# EasyEDA Pro project PCB_Design_Project.epro

# Schematic Schematic1_8
Board Name: Prototype_V5.2_328P; Create Date: 2024-12-31; Page Name: P1; Project Name: Cleanify; Schematic Name: Schematic1_8; Update Date: 2024-12-31; Company: EasyEDA.com; Drawn: EasyEDA; Page Size: A4; Part Number: JLCPCB-002; Reviewed: EasyEDA; Version: V0.1
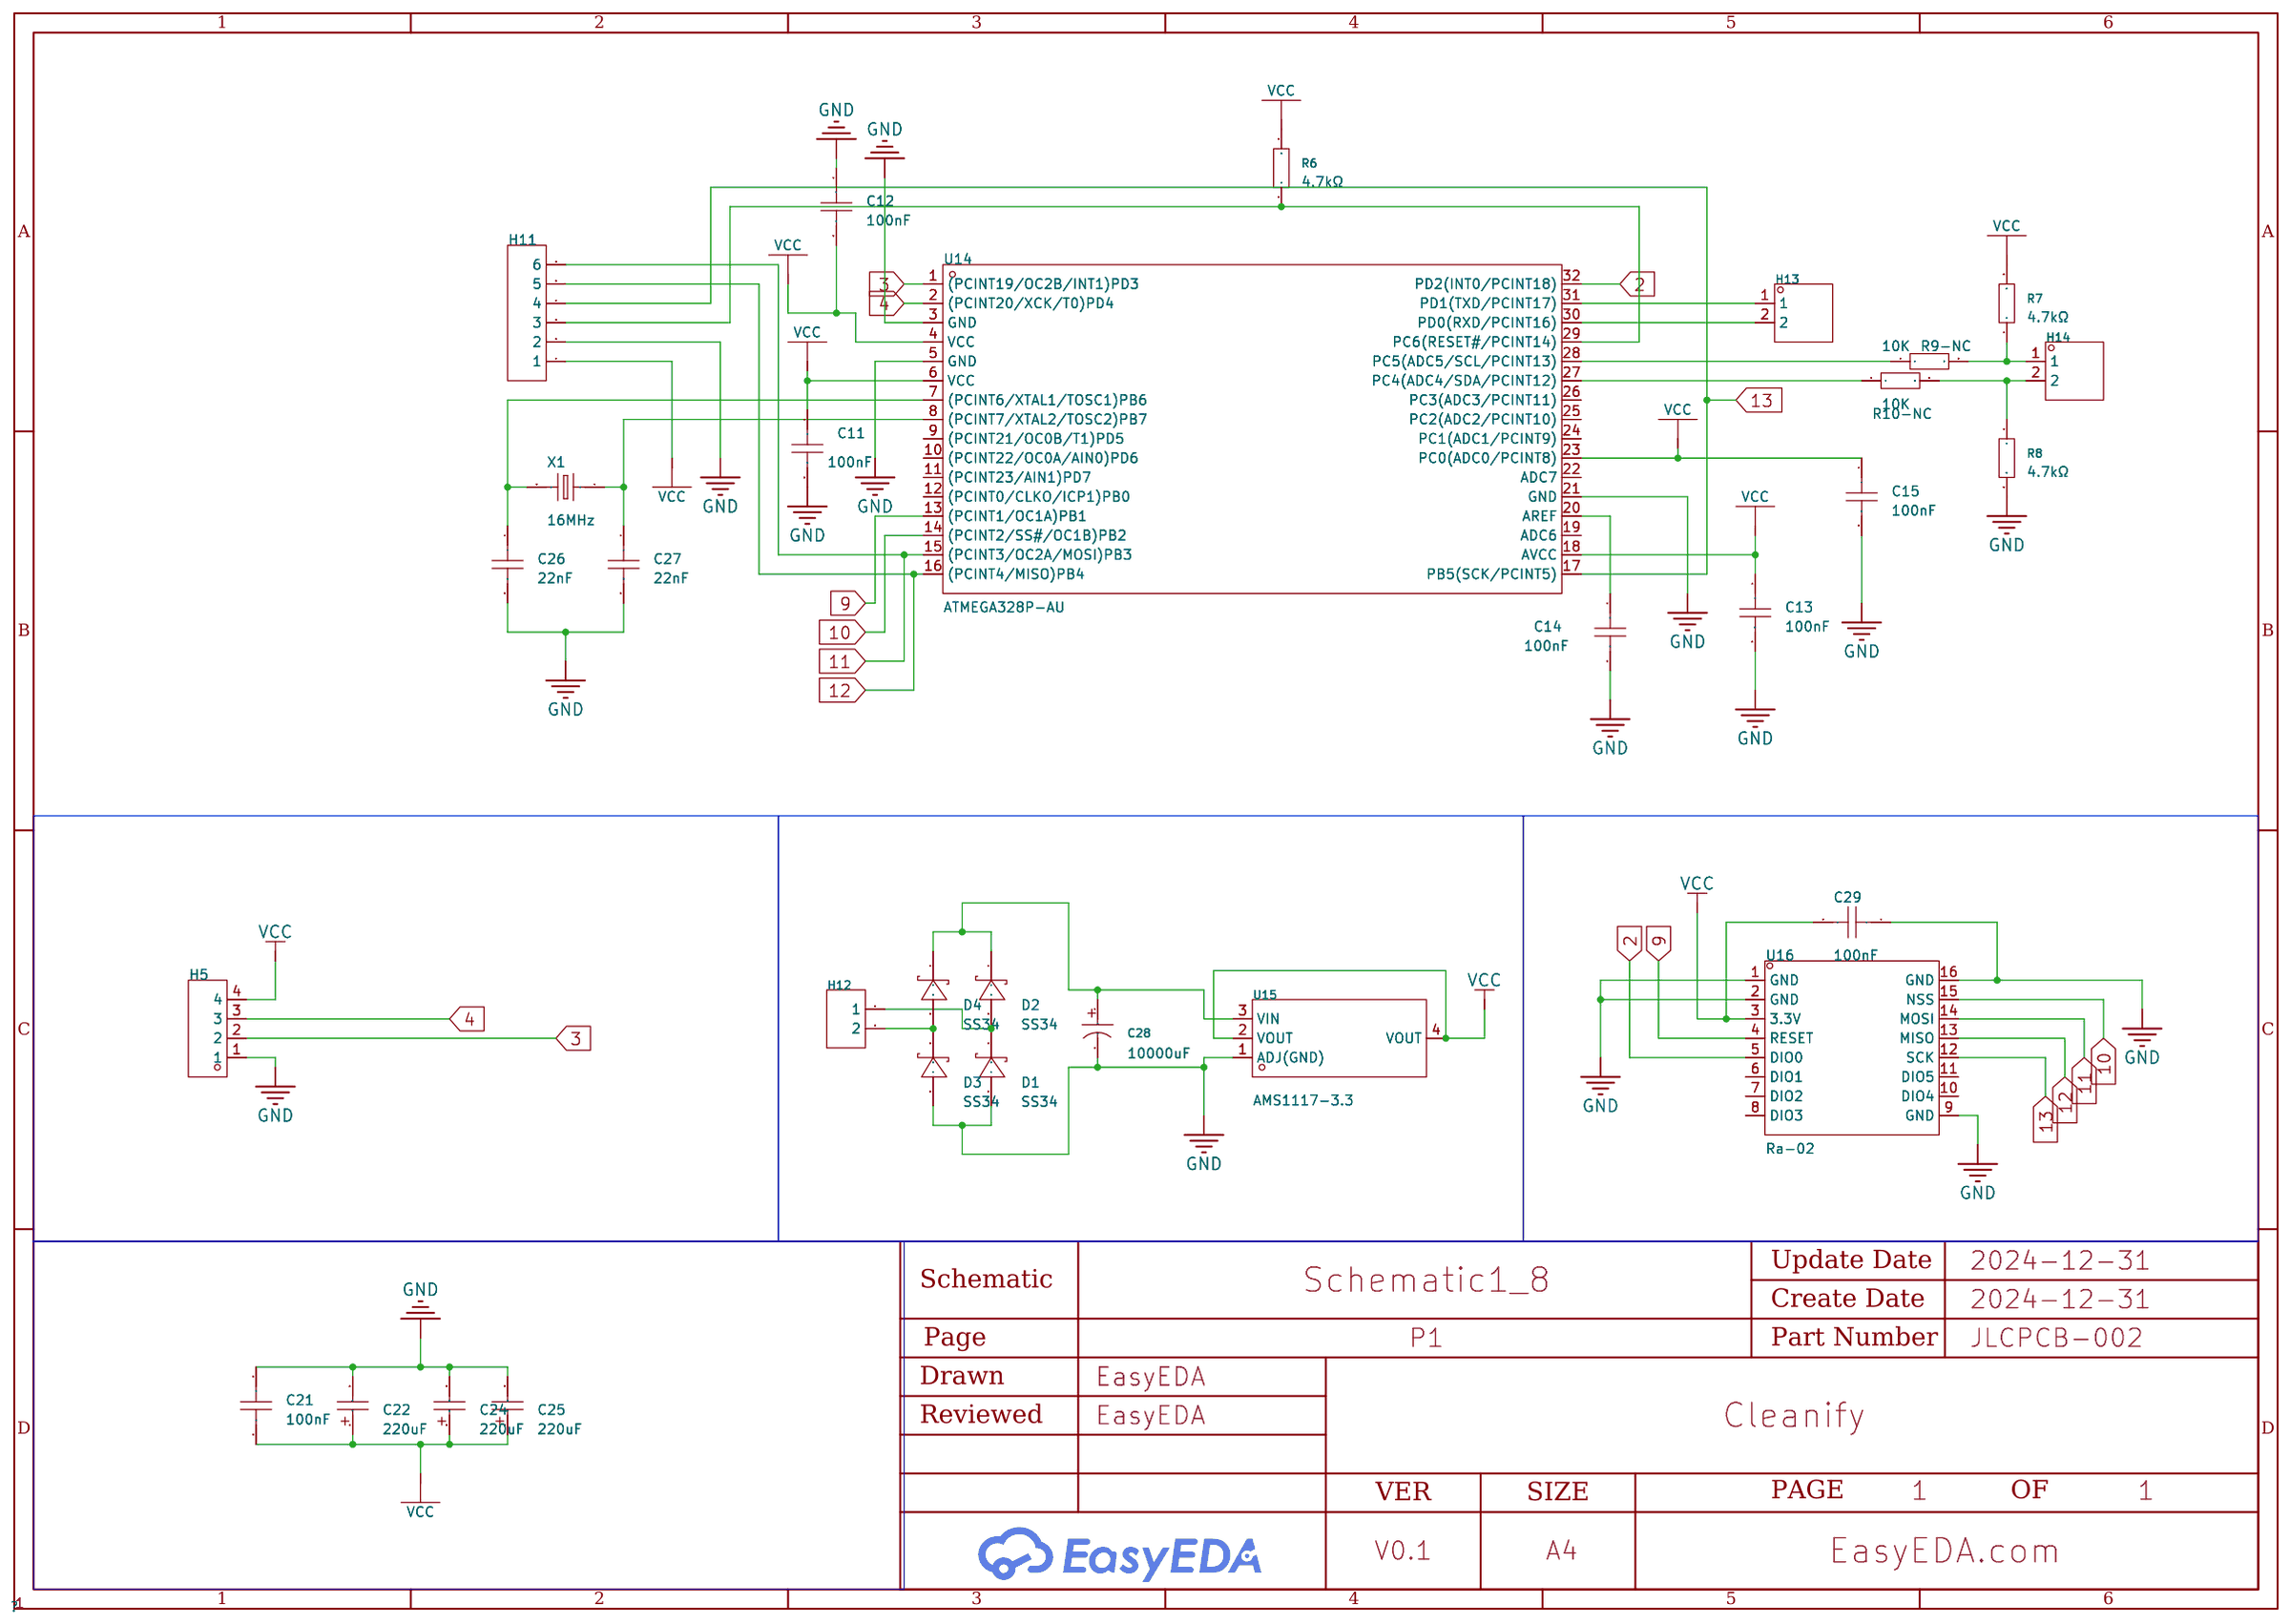
[diagram p0: schematic sheet]

## Parts
C11  100nF  [C0805]
C12  100nF  [C0805]
C13  100nF  [C0805]
C14  100nF  [C0805]
C15  100nF  [C0805]
C21  100nF  [C0805]
C22  220uF  [CAP-SMD_L3.5-W2.8-R-RD]
C24  220uF  [CAP-SMD_L3.5-W2.8-R-RD]
C25  220uF  [CAP-SMD_L3.5-W2.8-R-RD]
C26  22nF  [C0805]
C27  22nF  [C0805]
C28  10000uF  [CAP-TH_BD22.0-P10.00-D1.4-FD]
C29  100nF  [C0805]
D1  SS34  [SMA_L4.3-W2.6-LS5.2-RD]
D2  SS34  [SMA_L4.3-W2.6-LS5.2-RD]
D3  SS34  [SMA_L4.3-W2.6-LS5.2-RD]
D4  SS34  [SMA_L4.3-W2.6-LS5.2-RD]
H5  -  [HDR-TH_4P-P2.54-V-M]
H11  -  [HDR-TH_6P-P2.54-V-M-1]
H12  -  [HDR-TH_2P-P2.54-V-F]
H13  -  [HDR-TH_2P-P2.54-V-M-1]
H14  -  [HDR-TH_2P-P2.54-V-M-1]
R6  4.7kΩ  [R0805]
R7  4.7kΩ  [R0805]
R8  4.7kΩ  [R0805]
R9-NC  10K  [R0201]
R10-NC  10K  [R0201]
U14  ATMEGA328P-AU  [TQFP-32_L7.0-W7.0-P0.80-LS9.0-BL]
U15  AMS1117-3.3  [SOT-223-3_L6.5-W3.4-P2.30-LS7.0-BR]
U16  Ra-02  [WIRELM-SMD_RA-02-BL]
X1  16MHz  [HC-49US_L11.5-W4.5-P4.88]

## Library data of the parts
C11-C15 C21 C26 C27 C29 = CAP_0805: Supplier Footprint: 0805
C22 C24 C25 = TAJB227M004RNJ: Capacitance: Tolerance:±20% Tolerance:±20% Rated Voltage: Equivalent Series Resistance(ESR):1.1Ω@100kHz Operating Temperature:-55℃~+125℃ Operating Temperature:-55℃~+125℃; LCSC Part Name: 220uF ±20% 4V; Supplier Part: C7200; Manufacturer: Kyocera AVX; Supplier Footprint: CASE-B-3528; JLCPCB Part Class: Extended Part; Datasheet: https://atta.szlcsc.com/upload/public/pdf/source/20160107/1457707750344.pdf; Supplier: LCSC; Tolerance: ±20%; Equivalent Series Resistance(ESR): 1.1Ω@100kHz; Operating Temperature: -55℃~+125℃
C28 = KM109M016N30RR0VH2FP0: Capacitance:10000uF Tolerance:±20% Tolerance:±20% Rated Voltage: Lead Spacing: φD: L: Lifetime @ Temp:2000hrs@105℃; LCSC Part Name: 10000uF ±20% 16V; Supplier Part: C44579; Manufacturer: CX(承兴); Supplier Footprint: 插件,D22xL30mm; JLCPCB Part Class: Extended Part; Datasheet: https://atta.szlcsc.com/upload/public/pdf/source/20211027/06D6BA3719C264B639DC286D935D03EA.pdf; Supplier: LCSC; Tolerance: ±20%; Lifetime @ Temp: 2000hrs@105℃
D1-D4 = SS34_C8678: Diode Configuration:Independent Type Forward Voltage (Vf@If):550mV@3A Reverse Voltage (Vr):40V Rectified Current:3A Reverse Leakage Current (Ir):500uA@40V; LCSC Part Name: 电压:40V 电流:3A; Supplier Part: C8678; Manufacturer: MDD(辰达半导体); Supplier Footprint: SMA(DO-214AC); JLCPCB Part Class: Basic Part; Datasheet: https://atta.szlcsc.com/upload/public/pdf/source/20240710/2118BB86FDDB2E0B294389AC1F3F65C8.pdf; Supplier: LCSC; Diode Configuration: Independent Type; Forward Voltage (Vf@If): 550mV@3A; Reverse Voltage (Vr): 40V; Rectified Current: 3A; Reverse Leakage Current (Ir): 500uA@40V
H5 = HDR-M_2.54_1x4P: Supplier Footprint: Through
H11 = HDR-M_2.54_1x6P: Supplier Footprint: Through
H12 = HDR-F_2.54_1x2P: Supplier Footprint: Through
H13 H14 = HDR-M_2.54_1x2P: Supplier Footprint: Through
R6-R8 = RMC08054.7K1%N: Resistance: Tolerance:±1% Tolerance:±1% Power(Watts):; LCSC Part Name: 4.7kΩ ±1% 125mW; Supplier Part: C269746; Manufacturer: Tyohm(幸亚电阻); Supplier Footprint: 0805; JLCPCB Part Class: Extended Part; Datasheet: https://atta.szlcsc.com/upload/public/pdf/source/20190115/C325956_D27151D492FFB3C9AB4A6F14FE01F30A.pdf; Supplier: LCSC; Tolerance: ±1%
R9-NC R10-NC = Res_0201: Supplier Footprint: 0201
U14 = ATMEGA328P-AU_C14877: CPU Core:AVR Program Storage Size:32KB RAM Size:2KB GPIO Ports Number:23 Operating Voltage Range:1.8V~5.5V Operating Voltage Range:1.8V~5.5V CPU Maximum Speed:20MHz Program Memory Type:FLASH EEPROM:1KB Operating Temperature Range:-40℃~+85℃ Operating Tempe; LCSC Part Name: 基于AVR增强型RISC架构的低功耗CMOS 8位微控制器; Supplier Part: C14877; Manufacturer: MICROCHIP(美国微芯); Supplier Footprint: TQFP-32(7x7); JLCPCB Part Class: Extended Part; Datasheet: https://atta.szlcsc.com/upload/public/pdf/source/20140621/1457707095197.pdf; Supplier: LCSC; CPU Core: AVR; Program Storage Size: 32KB; RAM Size: 2KB; GPIO Ports Number: 23; Operating Voltage Range: 1.8V~5.5V; CPU Maximum Speed: 20MHz; Program Memory Type: FLASH; EEPROM: 1KB; Operating Temperature Range: -40℃~+85℃; ADC (Bit): 10bit; Peripheral/Function: WDT；PWM；WDT；PWM; Watchdog: 有; Low-Voltage Detect: 有; Internal Oscillator: 有
U15 = AMS1117-3.3_C2891839: Output Type: Maximum Input Voltage:18V Output Voltage:3.3V Output Voltage:3.3V MAX Output Current:1A Power Supply Rejection Ratio (PSRR):60dB@(120Hz) Dropout Voltage:1.3V@(1A) standby current:5mA Noise:0.005%Vout Feature:- Operating Temperature:-40℃~+125℃; LCSC Part Name: 输入18V 输出3.3V 1A; Supplier Part: C2891839; Manufacturer: YONGYUTAI(永裕泰); Supplier Footprint: SOT-223-3; JLCPCB Part Class: Extended Part; Datasheet: https://atta.szlcsc.com/upload/public/pdf/source/20210901/A75ADDE6A17DEE0002F2A58A8D1F3634.pdf; Supplier: LCSC; Maximum Input Voltage: 18V; Output Voltage: 3.3V; MAX Output Current: 1A; Power Supply Rejection Ratio (PSRR): 60dB@(120Hz); Dropout Voltage: 1.3V@(1A); standby current: 5mA; Noise: 0.005%Vout; Operating Temperature: -40℃~+125℃@(Tj); Output Polarity: Positive electrode; Number of Outputs: 1
U16 = Ra-02_C90039: Output Power:20dBm Output Power:20dBm Support Interface:SPI Modulation System:LoRa；OOK；MSK；GFSK；FSK；GMSK Operating Voltage:3.3V Operating Voltage:3.3V Antenna Type:IPEX Interface Receive  Current:12.15mA Send  Current:105mA Sensitivity:-140dBm Sensitivity; LCSC Part Name: 433MHz LORA扩频无线模块 超远10KM SX1278; Supplier Part: C90039; Manufacturer: Ai-Thinker(安信可); Supplier Footprint: SMD-16P; JLCPCB Part Class: Extended Part; Datasheet: https://atta.szlcsc.com/upload/public/pdf/source/20181018/C90039_B5D7ADB38ADA1100C85850A55553934D.pdf; Supplier: LCSC; Output Power: 20dBm; Support Interface: SPI; Modulation System: LoRa；OOK；MSK；GFSK；FSK；GMSK; Operating Voltage: 3.3V; Antenna Type: IPEX Interface; Receive  Current: 12.15mA; Send  Current: 105mA; Sensitivity: -140dBm; Operating Temperature: -40℃~+85℃
X1 = XIHCELNANF-16MHZ: Crystal Type:直插晶振 Frequency:16MHz Normal temperature Frequency Tolerance:±30ppm Normal temperature Frequency Tolerance:±30ppm External load capacitor:20pF Frequency Stability(Full temperature range):±30ppm Frequency Stability(Full temperature range):±30pp; LCSC Part Name: 16MHz ±30ppm 20pF; Supplier Part: C295075; Manufacturer: TAITIEN(泰艺电子); Supplier Footprint: HC-49S; JLCPCB Part Class: Extended Part; Datasheet: https://atta.szlcsc.com/upload/public/pdf/source/20190107/C358649_B3943D1FEB8737E4FCE005A191A94016.pdf; Supplier: LCSC; Crystal Type: 直插晶振; Normal temperature Frequency Tolerance: ±30ppm; External load capacitor: 20pF; Frequency Stability(Full temperature range): ±30ppm

## Nets
GND: C11.2 C12.1 C13.2 C14.2 C15.2 C21.1 C22.2 C24.2 C25.2 C26.2 C27.2 C28.2 C29.1 D1.2(A) D3.2(A) H5.1 H11.2 R8.2 U14.3(GND) U14.5(GND) U14.21(GND) U15.1(ADJ(GND)) U16.1(GND) U16.2(GND) U16.9(GND) U16.16(GND)
VCC: C11.1 C12.2 C13.1 C15.1 C21.2 C22.1 C24.1 C25.1 C29.2 H5.4 H11.1 R6.2 R7.2 U14.4(VCC) U14.6(VCC) U14.18(AVCC) U14.23(PC0(ADC0/PCINT8)) U15.2(VOUT) U15.4(VOUT) U16.3(3.3V)
2: U14.32(PD2(INT0/PCINT18)) U16.5(DIO0)
3: H5.2 U14.1((PCINT19/OC2B/INT1)PD3)
4: H5.3 U14.2((PCINT20/XCK/T0)PD4)
9: U14.13((PCINT1/OC1A)PB1) U16.4(RESET)
10: U14.14((PCINT2/SS#/OC1B)PB2) U16.15(NSS)
11: H11.6 U14.15((PCINT3/OC2A/MOSI)PB3) U16.14(MOSI)
12: H11.5 U14.16((PCINT4/MISO)PB4) U16.13(MISO)
13: H11.4 U14.17(PB5(SCK/PCINT5)) U16.12(SCK)
$1N4698: H11.3 R6.1 U14.29(PC6(RESET#/PCINT14))
$1N4704: C14.1 U14.20(AREF)
$1N4730: C27.1 U14.8((PCINT7/XTAL2/TOSC2)PB7) X1.1
$1N4731: C26.1 U14.7((PCINT6/XTAL1/TOSC1)PB6) X1.2
$1N5797: H13.1 U14.31(PD1(TXD/PCINT17))
$1N5801: H13.2 U14.30(PD0(RXD/PCINT16))
$1N8243: D1.1(K) D2.2(A) H12.1
$1N8315: D3.1(K) D4.2(A) H12.2
$1N8531: C28.1 D2.1(K) D4.1(K) U15.3(VIN)
$1N9580: R9-NC.1 U14.28(PC5(ADC5/SCL/PCINT13))
$1N9585: H14.1 R7.1 R9-NC.2
$1N9657: H14.2 R8.1 R10-NC.2
$1N9660: R10-NC.1 U14.27(PC4(ADC4/SDA/PCINT12))

Not connected (* = marked no-connect by the designer): U14 9((PCINT21/OC0B/T1)PD5) 10((PCINT22/OC0A/AIN0)PD6) 11((PCINT23/AIN1)PD7) 12((PCINT0/CLKO/ICP1)PB0) 19(ADC6) 22(ADC7) 24(PC1(ADC1/PCINT9)) 25(PC2(ADC2/PCINT10)) 26(PC3(ADC3/PCINT11)); U16 6(DIO1) 7(DIO2) 8(DIO3) 10(DIO4) 11(DIO5)

# Board PCB2_8
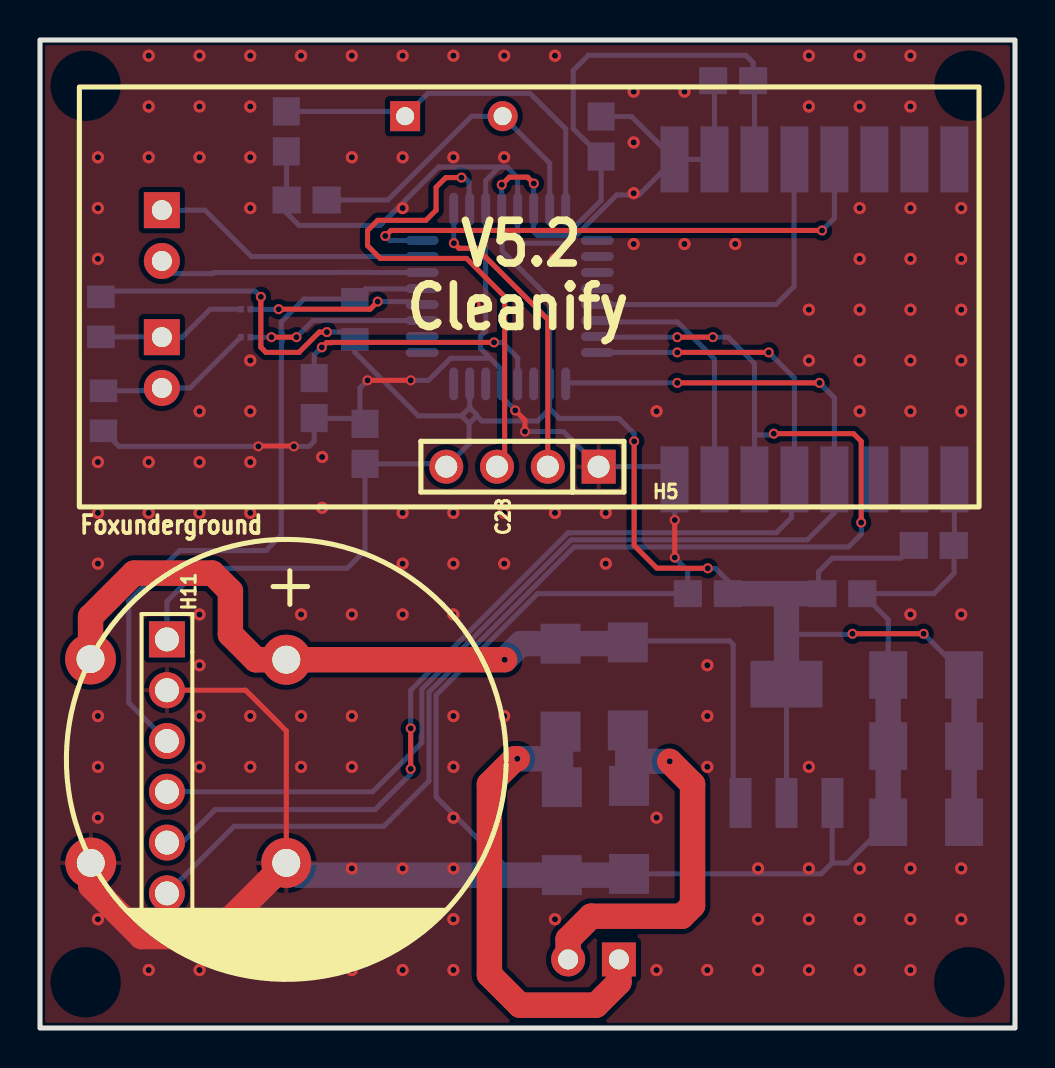
[diagram p1: board, top side]
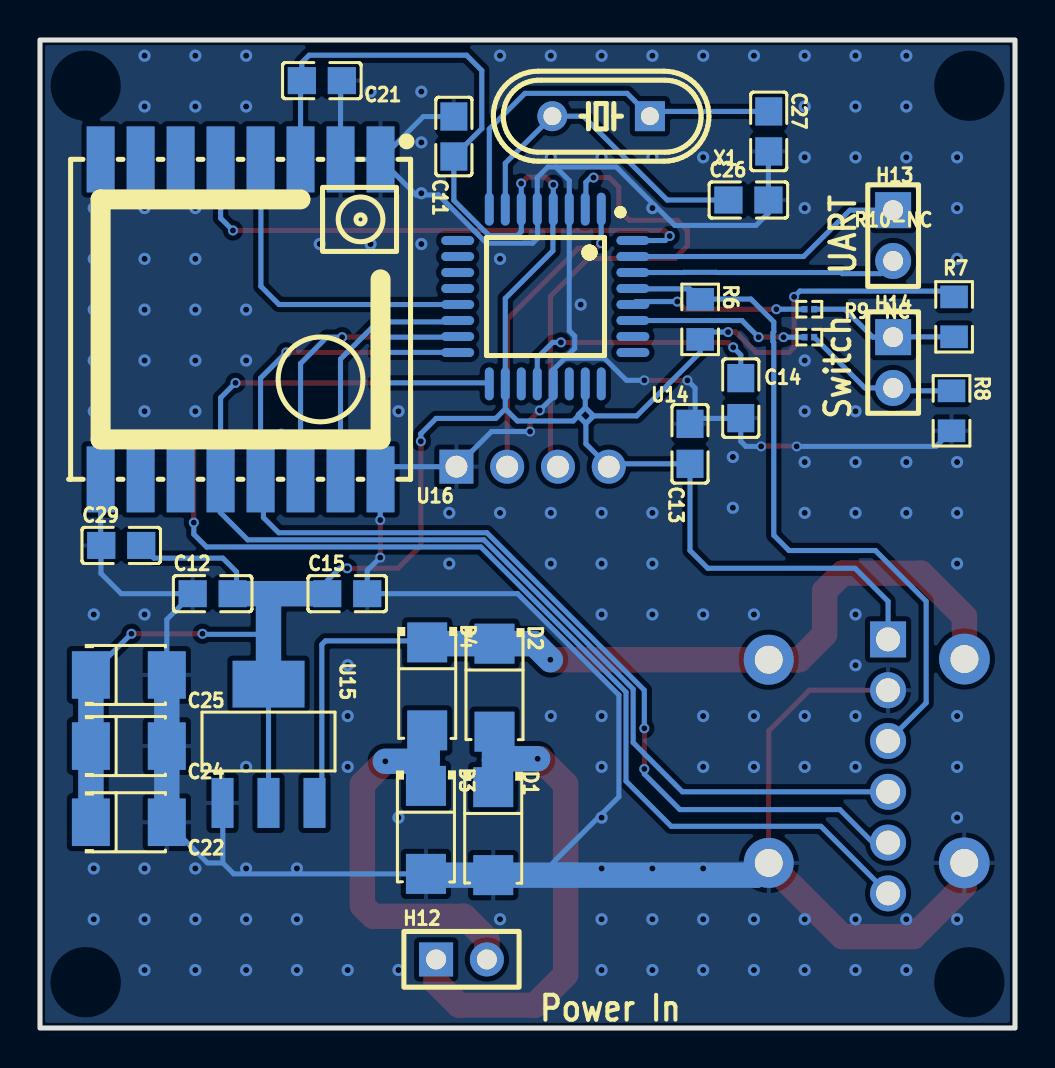
[diagram p2: board, bottom side, seen from below]

Outline 48.77 x 49.4 mm; copper layers: Top Layer, Bottom Layer. Coordinates in mm from the lower left corner of the outline.
Outline path: rectangle 0,49.4 48.77,0
Stack: Top Layer 0.035mm / Dielectric1 1.51mm FR4 er 4.5 / Bottom Layer 0.035mm

## Design rules (mm)
template: JLCPCB Capability(Two Layers Board)
spacing copperThickness1oz (default): track to track 0.102, other pairs 0.152 to 0.3
spacing copperThickness2oz: track to track 0.203, other pairs 0.152 to 0.3
track width copperThickness1oz (default): min 0.127, default 0.254, max 2.54
track width copperThickness2oz: min 0.203, default 0.254, max 2.54
differential pair differentialPair (default): width min 0.127, default 0.254, max 2.54; gap min 0.152, default 0.152
via viaSize (default): diameter min 0.5, default 0.61, max 10; hole min 0.3, default 0.305, max 6.3

## Placement (name value [footprint] x y rotation side)
C11  100nF  [C0805]  28.07 44.58 90 bottom
C12  100nF  [C0805]  40.13 21.72 180 bottom
C13  100nF  [C0805]  16.26 29.21 90 bottom
C14  100nF  [C0805]  13.72 31.5 270 bottom
C15  100nF  [C0805]  33.4 21.72 180 bottom
C21  100nF  [C0805]  34.67 47.37 0 bottom
C22  220uF  [CAP-SMD_L3.5-W2.8-R-RD]  44.32 10.29 0 bottom
C24  220uF  [CAP-SMD_L3.5-W2.8-R-RD]  44.32 14.1 0 bottom
C25  220uF  [CAP-SMD_L3.5-W2.8-R-RD]  44.32 17.65 0 bottom
C26  22nF  [C0805]  13.33 41.4 180 bottom
C27  22nF  [C0805]  12.32 44.83 270 bottom
C28  10000uF  [CAP-TH_BD22.0-P10.00-D1.4-FD]  12.32 13.34 270 top
C29  100nF  [C0805]  44.7 24.13 180 bottom
D1  SS34  [SMA_L4.3-W2.6-LS5.2-RD]  26.1 9.84 270 bottom
D2  SS34  [SMA_L4.3-W2.6-LS5.2-RD]  26.04 17.02 270 bottom
D3  SS34  [SMA_L4.3-W2.6-LS5.2-RD]  29.46 9.91 270 bottom
D4  SS34  [SMA_L4.3-W2.6-LS5.2-RD]  29.4 17.08 270 bottom
H5  -  [HDR-TH_4P-P2.54-V-M]  24.13 28.07 180 top
H11  -  [HDR-TH_6P-P2.54-V-M-1]  6.35 13.08 270 top
H12  -  [HDR-TH_2P-P2.54-V-F]  27.69 3.43 180 bottom
H13  -  [HDR-TH_2P-P2.54-V-M-1]  6.1 39.62 270 bottom
H14  -  [HDR-TH_2P-P2.54-V-M-1]  6.1 33.27 270 bottom
NOREF  -  [Pad_e642]  2.54 8.26 0 top
NOREF#2  -  [Pad_e644]  2.53 18.45 0 top
R6  4.7kΩ  [R0805]  15.75 35.43 270 bottom
R7  4.7kΩ  [R0805]  3.05 35.56 90 bottom
R8  4.7kΩ  [R0805]  3.17 30.86 270 bottom
R9-NC  10K  [R0201]  10.29 35.94 180 bottom
R10-NC  10K  [R0201]  10.29 34.54 180 bottom
U14  ATMEGA328P-AU  [TQFP-32_L7.0-W7.0-P0.80-LS9.0-BL]  23.49 36.58 0 bottom
U15  AMS1117-3.3  [SOT-223-3_L6.5-W3.4-P2.30-LS7.0-BR]  37.34 14.22 270 bottom
U16  Ra-02  [WIRELM-SMD_RA-02-BL]  38.73 35.43 0 bottom
X1  16MHz  [HC-49US_L11.5-W4.5-P4.88]  20.7 45.59 0 bottom

## Footprints (pads in the part's own frame, mm; a bottom-side part is the same pattern mirrored in y, then rotated)
C0805
  rect 1.41x1.35 smd: 1(-1,0) 2(1,0)
CAP-SMD_L3.5-W2.8-R-RD
  rect 1.9x2.376 smd: 1(1.899,0) 2(-1.899,0)
CAP-TH_BD22.0-P10.00-D1.4-FD
  round 2.5 hole 1.4: 1(-5.08,0) 2(5.08,0)
HC-49US_L11.5-W4.5-P4.88
  rect 1.5x1.5 hole 0.9: 1(-2.44,0)
  round 1.5 hole 0.9: 2(2.44,0)
HDR-TH_2P-P2.54-V-F
  rect 1.7x1.7 hole 1: 1(-1.27,0)
  round 1.7 hole 1: 2(1.27,0)
HDR-TH_2P-P2.54-V-M-1
  rect 1.8x1.8 hole 1: 1(-1.27,0)
  round 1.8 hole 1: 2(1.27,0)
HDR-TH_4P-P2.54-V-M
  rect 1.7x1.7 hole 1.1: 1(-3.81,0)
  round 1.7 hole 1.1: 2(-1.27,0) 3(1.27,0) 4(3.81,0)
HDR-TH_6P-P2.54-V-M-1
  rect 1.8x1.8 hole 1.2: 1(-6.35,0)
  round 1.8 hole 1.2: 2(-3.81,0) 3(-1.27,0) 4(1.27,0) 5(3.81,0) 6(6.35,0)
Pad_e642
  round 2.54 hole 1.397: 1(0,0)
Pad_e644
  round 2.54 hole 1.397: 1(0,0)
R0201
  rect 0.303x0.324 smd: 1(-0.241,0) 2(0.241,0)
R0805
  rect 1.133x1.377 smd: 1(-1,0) 2(1,0)
SMA_L4.3-W2.6-LS5.2-RD
  rect 2x2 smd: 1(-2.2,0) 2(2.2,0)
SOT-223-3_L6.5-W3.4-P2.30-LS7.0-BR
  rect 2.5x1.1 smd: 1(2.97,-2.3) 2(2.97,0) 3(2.97,2.3)
  rect 2.34x3.6 smd: 4(-2.97,0)
TQFP-32_L7.0-W7.0-P0.80-LS9.0-BL
  oval 0.45x1.65 smd: 1(-2.8,-4.369) 2(-2,-4.369) 3(-1.2,-4.369) 4(-0.4,-4.369) 5(0.4,-4.369) 6(1.2,-4.369) 7(2,-4.369) 8(2.8,-4.369) 17(2.8,4.369) 18(2,4.369) 19(1.2,4.369) 20(0.4,4.369) 21(-0.4,4.369) 22(-1.2,4.369) 23(-2,4.369) 24(-2.8,4.369)
  oval 1.65x0.45 smd: 9(4.381,-2.8) 10(4.381,-2) 11(4.381,-1.2) 12(4.381,-0.4) 13(4.381,0.4) 14(4.381,1.2) 15(4.381,2) 16(4.381,2.8) 25(-4.381,2.8) 26(-4.381,2) 27(-4.381,1.2) 28(-4.381,0.4) 29(-4.381,-0.4) 30(-4.381,-1.2) 31(-4.381,-2) 32(-4.381,-2.8)
WIRELM-SMD_RA-02-BL
  rect 1.4x3.302 smd: 1(-7,-8) 2(-5,-8) 3(-3,-8) 4(-1,-8) 5(1,-8) 6(3,-8) 7(5,-8) 8(7,-8) 9(7,8) 10(5,8) 11(3,8) 12(1,8) 13(-1,8) 14(-3,8) 15(-4.998,8) 16(-7,8)

## Nets
As in the schematic, except:
GND: C11.2 C12.1 C13.2 C14.2 C15.2 C21.1 C22.2 C24.2 C25.2 C26.2 C27.2 C28.2 C29.1 D1.2 D3.2 H5.1 H11.2 NOREF.1 R8.2 U14.3 U14.5 U14.21 U15.1 U16.1 U16.2 U16.9 U16.16
$1N8531: C28.1 D2.1 D4.1 NOREF#2.1 U15.3

Pads without a net: U14 9 10 11 12 19 22 24 25 26; U16 6 7 8 10 11

## Via types
v1: diameter 0.61, hole 0.305, Top Layer to Bottom Layer, 143 vias
v2: diameter 0.5, hole 0.299, Top Layer to Bottom Layer, 38 vias
v3: diameter 0.5, hole 0.3, Top Layer to Bottom Layer, 1 via

## Routing (per net, layer and track width the routed paths; a pad name or vN(x,y) marks a point on that pad's centre or on a via; arc(x,y) is an arc through that point)
GND: length 199.5
  Top Layer w0.254: v2(23.77,30.88) 24.26,30.4 v2(24.26,29.82) ; C28.2 12.32,14.86 10.29,16.89 H11.2 ; v2(10.92,29.08) 10.94,29.1 12.68,29.1 v2(12.7,29.08) ; v2(18.54,32.39) v2(16.38,32.39) ; v2(31.75,23.52) v2(31.75,25.4)
  Top Layer w1.27: NOREF.1 2.54,7.11 5.08,4.57 8.64,4.57 C28.2
  Bottom Layer w0.254: C21.1 33.73,47.31 U16.2 U16.1 ; C22.2 40.39,8.26 39.62,8.26 ; 22.97,43.05 22.3,42.37 U14.3 22.3,34.87 22.02,34.6 22.02,33.98 22.52,33.49 ; 22.97,43.05 19.94,43.05 17.02,40.13 12.95,40.13 12.33,40.75 C26.2 12.33,43.82 C27.2 ; 22.97,43.05 23.37,43.05 23.89,42.53 U14.5 23.88,40.93 23.88,39.5 24.13,39.24 26.43,39.24 28.84,41.66 29.96,41.66 U16.1 ; 22.52,33.49 23.1,32.91 U14.21 23.1,31.56 v2(23.77,30.88) ; 22.52,33.49 20.53,33.49 19.43,32.39 v2(18.54,32.39) ; v2(31.75,23.52) 32.4,22.87 C15.2 24.88,21.72 19.81,16.65 19.81,11.56 23.11,8.26 ; v2(12.7,29.08) 13.46,29.08 13.72,29.34 C14.2 ; 39.62,8.26 39.62,11.24 39.64,11.25 ; 39.62,8.26 39.08,7.71 D3.2 ; v2(24.26,29.82) 26.18,29.82 H5.1 31.1,28.07 U16.16 31.75,27.42 v2(31.75,25.4) ; C25.2 42.42,20.42 C12.1 44.7,21.72 45.72,22.73 45.72,24.11 C29.1 45.73,24.16 U16.9 ; C11.2 29.59,45.58 U16.1 ; v2(10.92,29.08) 3.95,29.08 R8.2 ; 13.72,30.62 13.78,30.56 ; 16,30.46 16,32 v2(16.38,32.39) ; 16,30.46 C13.2 ; 16,30.46 15.99,30.48 13.86,30.48
  Bottom Layer w1.27: D3.2 29.4,7.64 D1.2 12.93,7.64 C28.2 ; C22.2 C24.2 C25.2
  vias: v1(2.9,43.54) v1(2.9,41) v1(2.9,38.46) v1(2.9,28.3) v1(2.9,25.76) v1(2.9,23.22) v1(2.9,15.6) v1(2.9,13.06) v1(2.9,10.52) v1(2.9,5.44) v1(5.44,48.62) v1(5.44,46.08) v1(5.44,43.54) v1(5.44,28.3) v1(5.44,25.76) v1(5.44,5.44) v1(5.44,2.9) v1(7.98,48.62) v1(7.98,46.08) v1(7.98,43.54) v1(7.98,30.84) v1(7.98,28.3) v1(7.98,25.76) v1(7.98,20.68) v1(7.98,18.14) v1(7.98,15.6) v1(7.98,13.06) v1(7.98,5.44) v1(7.98,2.9) v1(10.52,48.62) v1(10.52,46.08) v1(10.52,43.54) v1(10.52,41) v1(10.52,33.38) v1(10.52,30.84) v1(10.52,28.3) v1(10.52,25.76) v1(10.52,15.6) v1(10.52,13.06) v1(10.52,5.44) v1(10.52,2.9) v1(13.06,48.62) v1(13.06,20.68) v1(13.06,15.6) v1(13.06,13.06) v1(13.06,5.44) v1(13.06,2.9) v1(14.11,28.55) v1(14.11,26.01) v1(15.6,48.62) v1(15.6,43.54) v1(15.6,20.68) v1(15.6,15.6) v1(15.6,13.06) v1(15.6,7.98) v1(15.6,5.44) v1(15.6,2.9) v1(18.14,48.62) v1(18.14,43.54) v1(18.14,41) v1(18.14,25.76) v1(18.14,23.22) v1(18.14,20.68) v1(18.14,7.98) v1(18.14,5.44) v1(18.14,2.9) v1(20.68,48.62) v1(20.68,43.54) v1(20.68,25.76) v1(20.68,23.22) v1(20.68,20.68) v1(20.68,15.6) v1(20.68,13.06) v1(20.68,10.52) v1(20.68,7.98) v1(20.68,5.44) v1(20.68,2.9) v1(21.72,36.17) v1(23.22,48.62) v1(23.22,43.54) v1(23.22,25.76) v1(23.22,23.22) v1(23.22,15.6) v1(25.76,48.62) v1(25.76,38.46) v1(25.76,25.76) v1(25.76,5.44) v1(28.3,25.76) v1(28.3,23.22) v1(29.7,46.82) v1(29.7,44.28) v1(29.7,41.74) v1(29.7,39.2) v1(30.84,30.84) v1(30.84,10.52) v1(30.84,2.9) v1(32.23,46.82) v1(32.23,39.2) v1(33.38,18.14) v1(33.38,15.6) v1(33.38,13.06) v1(33.38,2.9) v1(34.77,39.2) v1(35.92,7.98) v1(35.92,5.44) v1(35.92,2.9) v1(38.46,48.62) v1(38.46,46.08) v1(38.46,35.92) v1(38.46,33.38) v1(38.46,13.06) v1(38.46,7.98) v1(38.46,5.44) v1(38.46,2.9) v1(41,48.62) v1(41,46.08) v1(41,41) v1(41,38.46) v1(41,35.92) v1(41,33.38) v1(41,30.84) v1(41,7.98) v1(41,5.44) v1(41,2.9) v1(43.54,48.62) v1(43.54,46.08) v1(43.54,41) v1(43.54,38.46) v1(43.54,35.92) v1(43.54,33.38) v1(43.54,30.84) v1(43.54,20.68) v1(43.54,7.98) v1(43.54,5.44) v1(43.54,2.9) v1(46.08,41) v1(46.08,38.46) v1(46.08,35.92) v1(46.08,33.38) v1(46.08,30.84) v1(46.08,20.68) v1(46.08,7.98) v1(46.08,5.44)
VCC: length 151.8
  Top Layer w0.254: v2(24.7,42.23) 24.38,42.55 23.48,42.55 v2(23.1,42.16) ; v2(33.4,22.99) 31.98,22.99 31.97,22.99 30.85,22.99 29.72,24.13 v2(29.72,29.34) ; v2(11.05,36.56) 11.05,34.04 11.3,33.78 12.95,33.78 13.97,34.8 v2(14.35,34.8) ; v2(40.64,19.71) v2(44.2,19.71)
  Bottom Layer w0.254: U15.2 U15.4 ; 21.84,30.61 22.1,30.35 24.89,30.35 25.49,30.96 ; 21.84,30.61 21.46,30.23 ; 21.84,30.61 21.84,30.67 21.49,31.02 ; v2(24.7,42.23) 24.7,42.22 U14.6 24.7,39.82 24.89,39.62 26.31,39.62 28.07,41.38 C11.1 26.67,44.97 26.67,47.88 27.43,48.64 35.31,48.64 35.67,48.28 C21.2 35.73,47.31 U16.3 ; 21.15,30.67 21.49,31.02 ; 21.15,30.67 21.15,30.54 21.46,30.23 ; 21.15,30.67 21.08,30.61 18.92,30.61 15.75,33.78 R6.2 15.38,34.8 v2(14.35,34.8) ; 21.49,31.02 U14.23 ; 21.46,30.23 21.46,29.21 H5.4 20.18,28.21 C13.1 16.26,23.88 15.37,22.99 8,22.99 6.35,21.34 H11.1 ; 25.49,30.96 25.97,30.48 28.96,30.48 29.72,29.72 v2(29.72,29.34) ; 25.49,30.96 U14.18 25.49,36.48 23.11,38.86 23.11,40.93 U14.4 v2(23.1,42.16) ; v2(40.64,19.71) 40.61,19.68 37.62,19.68 ; C29.2 43.07,23.5 39.62,23.5 38.94,22.81 38.94,21.91 C12.2 ; R7.2 3.34,36.85 10.76,36.85 v2(11.05,36.56) ; v2(33.4,22.99) 33.78,22.99 34.4,22.37 C15.1 ; v2(44.2,19.71) 46.22,17.69
  Bottom Layer w1.27: C25.1 C24.1 C22.1 ; U15.4 37.34,21.6 37.4,21.66 ; C15.1 C12.2
2: length 27.7
  Top Layer w0.254: v2(17.27,39.6) 17.55,39.88 v2(39.12,39.88)
  Bottom Layer w0.254: v2(39.12,39.88) 39.73,40.5 U16.5 ; v2(17.27,39.6) 17.5,39.38 U14.32
3: length 15.3
  Top Layer w0.254: v2(20.7,39.24) 20.95,38.99 21.84,38.99 25.4,35.43 H5.2
  Bottom Layer w0.254: v2(20.7,39.24) 20.7,40.94 U14.1
4: length 25.6
  Top Layer w0.254: H5.3 23.24,28.45 23.24,36.58 21.34,38.48 17.02,38.48 16.38,39.12 16.38,39.88 16.89,40.39 19.3,40.39 19.81,40.89 19.81,42.04 20.3,42.52 v2(21.08,42.52)
  Bottom Layer w0.254: U14.2 21.46,40.98 21.46,42.29 21.23,42.52 v2(21.08,42.52)
9: length 16.6
  Bottom Layer w0.254: U16.4 37.72,43.42 37.72,37.08 36.81,36.18 U14.13
10: length 12.7
  Bottom Layer w0.254: U16.15 33.74,33.45 31.88,35.31 27.95,35.31 U14.14
11: length 69.2
  Top Layer w0.254: v2(36.7,29.72) 40.69,29.72 41.07,29.34 v2(41.07,25.27) ; v2(33.65,34.54) v2(31.88,34.54)
  Bottom Layer w0.254: v2(36.7,29.72) 36.64,29.66 35.73,29.66 ; U16.14 35.73,29.66 ; 35.73,29.66 35.73,33.23 34.42,34.54 v2(33.65,34.54) ; v2(31.88,34.54) 27.91,34.54 U14.15 ; v2(41.07,25.27) 41.07,24.69 40.44,24.05 26.71,24.05 19.46,16.8 19.46,12.34 17.2,10.09 9.7,10.09 H11.6
12: length 57.9
  Top Layer w0.254: v2(36.45,33.78) v2(31.88,33.78) ; v2(18.54,14.99) v2(18.54,12.95)
  Bottom Layer w0.254: v2(36.45,33.78) 37.73,32.5 U16.13 37.59,27.29 37.59,25.53 36.83,24.77 26.42,24.77 18.54,16.89 v2(18.54,14.99) ; U14.16 27.88,33.78 v2(31.88,33.78) ; H11.5 7.11,9.27 8.76,10.92 16.76,10.92 18.54,12.7 v2(18.54,12.95)
13: length 60.3
  Top Layer w0.254: v2(38.99,32.26) v2(31.88,32.26)
  Bottom Layer w0.254: H11.4 16.64,11.81 19.1,14.27 19.1,16.95 26.56,24.41 38.38,24.41 39.75,25.78 39.75,27.42 U16.12 39.73,31.51 v2(38.99,32.26) ; U14.17 26.35,32.26 v2(31.88,32.26)
$1N4698: length 35.2
  Bottom Layer w0.254: H11.3 4.45,16.26 4.45,21.34 6.98,23.88 11.3,23.88 12.07,24.64 12.07,34.28 12.11,34.33 12.11,34.76 12.07,34.81 12.07,35.31 13.21,36.45 15.73,36.45 R6.1 16.27,36.96 19.09,36.96 U14.29
$1N4704: length 13.1
  Top Layer w0.254: v2(14.1,34.04) 14.33,34.27 14.57,34.27 14.58,34.28 v2(22.71,34.28)
  Bottom Layer w0.254: U14.20 23.89,33.51 23.12,34.28 v2(22.71,34.28) ; 13.72,32.62 13.72,33.66 v2(14.1,34.04)
$1N4730: length 19.5
  Bottom Layer w0.254: 12.07,45.83 18.02,45.83 X1.1 19.4,46.74 24.51,46.74 26.3,44.95 U14.8
$1N4731: length 16.2
  Bottom Layer w0.254: C26.1 17.4,41.4 21.59,45.59 X1.2 25.49,43.24 U14.7
$1N5797: length 14
  Bottom Layer w0.254: U14.31 10.57,38.58 8.26,40.89 H13.1
$1N5801: length 13.3
  Bottom Layer w0.254: U14.30 16.56,37.78 16.55,37.79 14.94,37.79 14.93,37.78 8.69,37.78 8.64,37.72 6.73,37.72 H13.2
$1N8243: length 25.2
  Top Layer w1.27: v2(23.88,13.46) 23.75,13.46 22.48,12.19 22.48,2.67 24,1.14 27.81,1.14 28.96,2.29 H12.1
  Bottom Layer w1.27: D2.2 26.04,13.38 ; 26.04,13.38 26.04,12.11 D1.1 ; 26.04,13.38 25.96,13.46 v2(23.88,13.46)
$1N8315: length 20.6
  Top Layer w1.27: v2(31.5,13.34) 32.64,12.19 32.64,6.12 32.11,5.59 27.56,5.59 26.42,4.45 26.42,3.43
  Bottom Layer w1.27: 29.4,13.53 29.6,13.34 v2(31.5,13.34) ; 29.4,13.53 29.4,12.17 D3.1 ; 29.4,13.53 D4.2
$1N8531: length 46.7
  Top Layer w1.27: NOREF#2.1 2.53,20.57 4.7,22.74 8.63,22.74 9.52,21.84 9.52,19.69 10.8,18.42 C28.1 v3(23.24,18.42)
  Bottom Layer w0.254: U15.3 34.67,11.62 34.67,19.18 34.49,19.36 29.48,19.36
  Bottom Layer w1.27: D4.1 29.34,19.22 D2.1 24.04,19.22 v3(23.24,18.42)
$1N9580: length 8.8
  Top Layer w0.254: v2(11.94,35.94) 16.51,35.94 v2(16.89,36.32)
  Bottom Layer w0.254: U14.28 18.97,36.32 v2(16.89,36.32) ; R9-NC.1 v2(11.94,35.94)
$1N9585: length 7.6
  Bottom Layer w0.254: R7.1 6.08,34.56 H14.1 7.11,34.54 8.51,35.94 R9-NC.2
$1N9657: length 8
  Bottom Layer w0.254: R8.1 5.95,31.86 6.1,32 7.51,32 R10-NC.2
$1N9660: length 8.9
  Top Layer w0.254: v2(12.83,34.54) v2(11.58,34.54)
  Bottom Layer w0.254: v2(11.58,34.54) R10-NC.1 ; U14.27 13.66,35.38 v2(12.83,34.54)

## Copper pours and planes (outline as drawn; the poured copper is in the pictures)
GND on Top Layer: 0,49.4 48.77,49.4 48.77,0 0,0
GND on Bottom Layer: 0,49.4 48.77,49.4 48.77,0 0,0

## Text on the board
Bottom Silkscreen Layer: UART | Switch | Power In
Top Silkscreen Layer: Foxunderground | Cleanify | V5.2
